# EasyEDA Pro project MFU.eprj, schematic HUB_STEP
Board Name: HUB_STEP; Create Date: 2025-11-01; Page Name: P1; Project Name: MFU_V3_mainboard; Schematic Name: HUB_STEP; Update Date: 2025-12-24; Company: EasyEDA.com; Page Size: A4; Version: V1.0
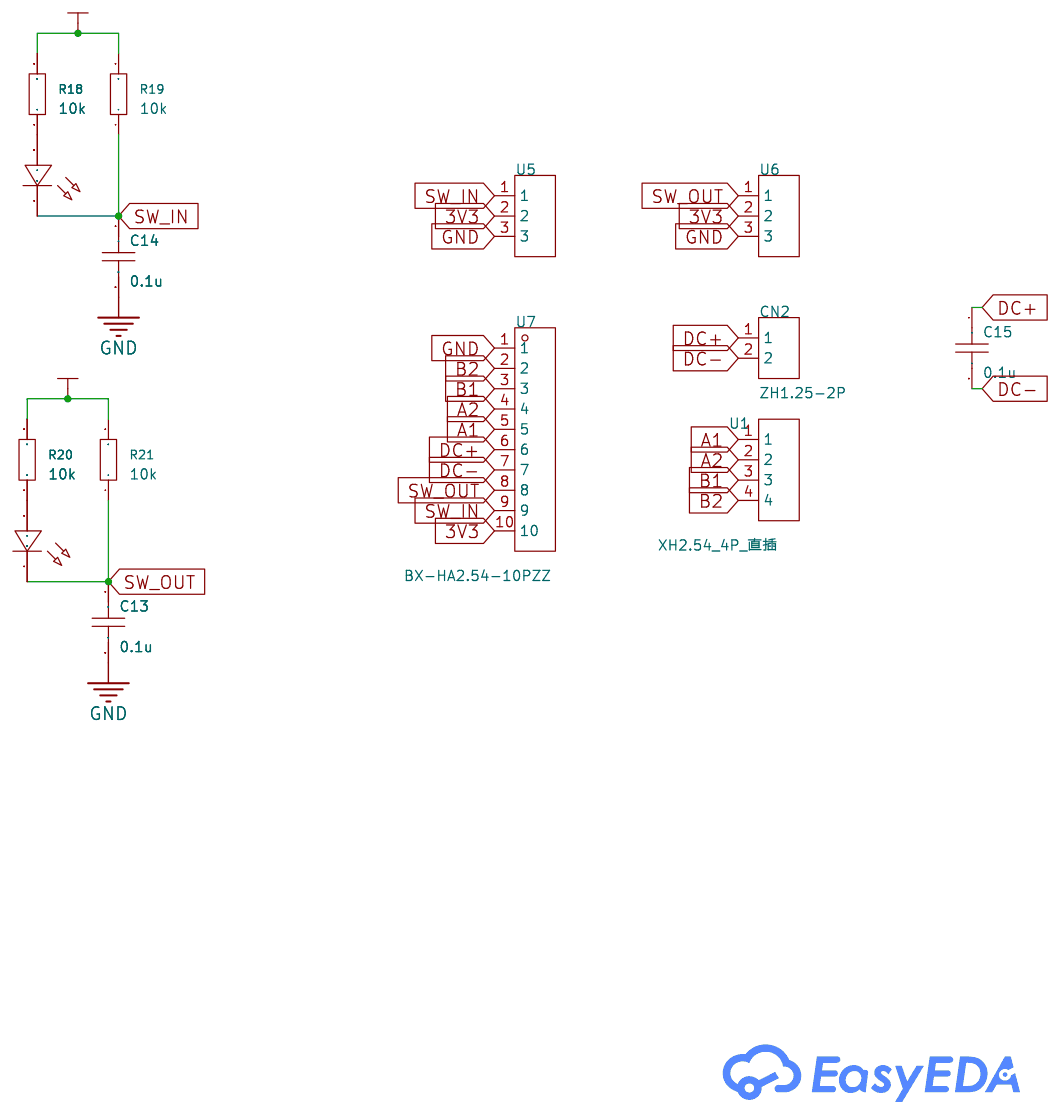
[diagram p1: schematic sheet]

## Parts
C13  0.1u  [C0805]
C14  0.1u  [C0805]
C15  0.1u  [C0805]
CN2  ZH1.25-2P  [CONN-TH_2P-P1.25-V-M_721]
LED5  -  [LED0603-R-RD]
LED6  -  [LED0603-R-RD]
R18  10k  [R0805]
R19  10k  [R0805]
R20  10k  [R0805]
R21  10k  [R0805]
U1  XH2.54_4P_直插  [CONN-TH_4P-P2.50-XH2.54-4P]
U5  电池端子3pin  [CONN-TH_3P-P1.25_C9900015739]
U6  电池端子3pin  [CONN-TH_3P-P1.25_C9900015739]
U7  BX-HA2.54-10PZZ  [CONN-TH_10P-P2.50_BX-HA2.54-10PZZ]

## Library data of the parts
C13-C15 = CAP_0805: Supplier Footprint: 0805
CN2 = ZH1.25-2P: Supplier Part: C9900004510; Supplier Footprint: 插件; JLCPCB Part Class: Extended Part; Supplier: LCSC
LED5 LED6 = LED_0603-B: Supplier Footprint: 0603
R18-R21 = 0805W8F2001T5E: Type:Thick Film Resistors Resistance:2kΩ Tolerance:±1% Tolerance:±1% Power(Watts): Overload Voltage (Max): Temperature Coefficient:±100ppm/℃ Temperature Coefficient:±100ppm/℃ Operating Temperature Range:-55℃~+155℃ Operating Temperature Range:-55℃~+155℃; LCSC Part Name: 2kΩ ±1% 125mW 厚膜电阻; Supplier Part: C17604; Manufacturer: UNI-ROYAL(厚声); Supplier Footprint: 0805; JLCPCB Part Class: Basic Part; Datasheet: https://atta.szlcsc.com/upload/public/pdf/source/20200306/C422600_1E6D84923E4A46A82E41ADD87F860B5C.pdf; Supplier: LCSC; Type: Thick Film Resistors; Tolerance: ±1%; Temperature Coefficient: ±100ppm/℃; Operating Temperature Range: -55℃~+155℃
U1 = XH2.54_4P_直插: Supplier Part: C9900008616; Supplier Footprint: XH2.54_4P; JLCPCB Part Class: Extended Part; Supplier: LCSC
U5 U6 = 电池端子3pin: Supplier Part: C9900015739; Supplier Footprint: 1.25mm-3pin直针; JLCPCB Part Class: Extended Part; Supplier: LCSC
U7 = BX-HA2.54-10PZZ_C9900095090: Supplier Part: C9900095090; JLCPCB Part Class: Extended Part; Supplier: LCSC

## Nets
3V3: R18.2 R19.2 R20.2 R21.2 U5.2 U6.2 U7.10
GND: C13.2 C14.2 U5.3 U6.3 U7.1
A1: U1.1 U7.5
A2: U1.2 U7.4
B1: U1.3 U7.3
B2: U1.4 U7.2
DC+: C15.1 CN2.1 U7.6
DC-: C15.2 CN2.2 U7.7
SW_IN: C14.1 LED5.1(C) R19.1 U5.1 U7.9
SW_OUT: C13.1 LED6.1(C) R21.1 U6.1 U7.8
$1N1154: LED5.2(A) R18.1
$1N1286: LED6.2(A) R20.1
